# Altium schematic sheet key.SchDoc
size A4
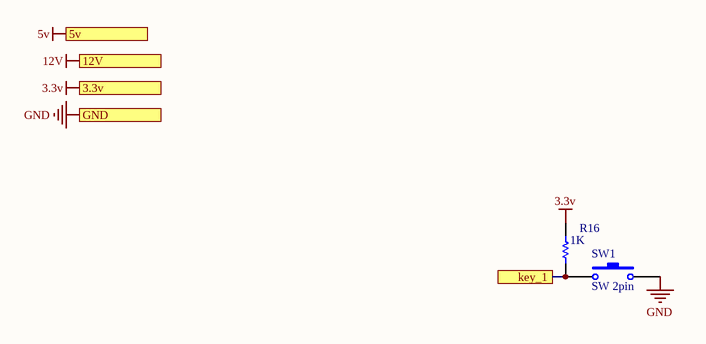
[diagram p0: key.SchDoc]

## Parts
R16  value 1K  [RES 0805 optional]  (hidden comment: resistor)
SW1  SW 2pin  [SW 2PIN]

## Ports
3.3v, 5v, 12V, GND, key_1

## Nets
3.3v: R16.2 ; port 3.3v
5v: port 5v
12V: port 12V
GND: SW1.2 ; port GND
key_1: R16.1 SW1.1 ; port key_1